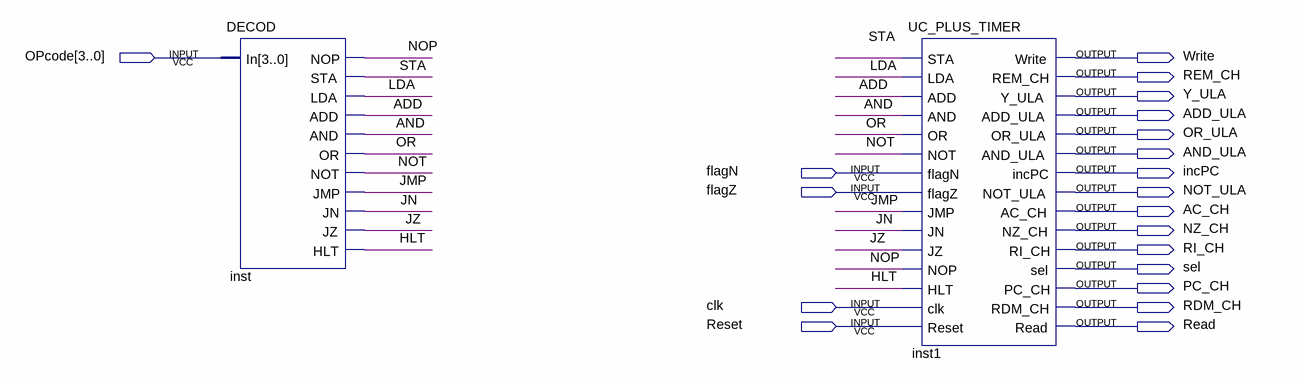
[diagram p0: schematic sheet]
// Quartus schematic instruction_LOGIC.bdf as structural Verilog: 2 symbols, 20 pins
module instruction_LOGIC (
  input  [3:0] OPcode,
  input  flagN,
  input  flagZ,
  input  clk,
  input  Reset,
  output Write,
  output REM_CH,
  output Y_ULA,
  output ADD_ULA,
  output OR_ULA,
  output AND_ULA,
  output incPC,
  output NOT_ULA,
  output AC_CH,
  output NZ_CH,
  output RI_CH,
  output sel,
  output PC_CH,
  output RDM_CH,
  output Read
);

  wire ADD, AND, HLT, JMP, JN, JZ, LDA, NOP, NOT, OR, STA;

  DECOD inst (
    .In(OPcode), .NOP(NOP), .STA(STA), .LDA(LDA), .ADD(ADD), .AND(AND), .OR(OR), .NOT(NOT), .JMP(JMP),
    .JN(JN), .JZ(JZ), .HLT(HLT));
  UC_PLUS_TIMER inst1 (
    .STA(STA), .LDA(LDA), .ADD(ADD), .AND(AND), .OR(OR), .NOT(NOT), .flagN(flagN), .flagZ(flagZ), .JMP(JMP),
    .JN(JN), .JZ(JZ), .NOP(NOP), .HLT(HLT), .clk(clk), .Reset(Reset), .Write(Write), .REM_CH(REM_CH),
    .Y_ULA(Y_ULA), .ADD_ULA(ADD_ULA), .OR_ULA(OR_ULA), .AND_ULA(AND_ULA), .incPC(incPC), .NOT_ULA(NOT_ULA),
    .AC_CH(AC_CH), .NZ_CH(NZ_CH), .RI_CH(RI_CH), .sel(sel), .PC_CH(PC_CH), .RDM_CH(RDM_CH), .Read(Read));
endmodule
